# Altium schematic sheet TopLevel.SchDoc
size B; SheetNumber: 1; SheetTotal: 4
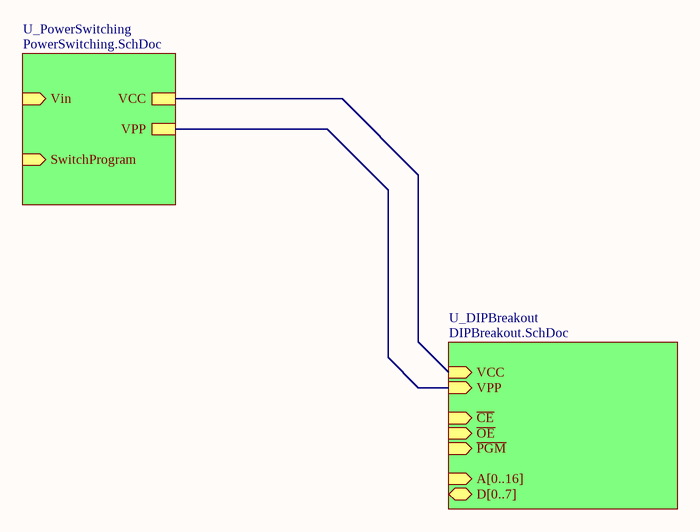
[diagram p0: TopLevel.SchDoc]

## Sub-sheets
U_DIPBreakout = DIPBreakout.SchDoc: A[0..16] (in), D[0..7] (bidir), VCC (in), VPP (in), ~{PGM} (in), ~{OE} (in), ~{CE} (in)
U_PowerSwitching = PowerSwitching.SchDoc: Vin (in), SwitchProgram (in), VCC, VPP

## Nets
(unnamed): sheet U_PowerSwitching/VCC, sheet U_DIPBreakout/VCC
(unnamed): sheet U_PowerSwitching/VPP, sheet U_DIPBreakout/VPP